# EAGLE design sx-fundec45-rev3 (EAGLE 6.5.0)
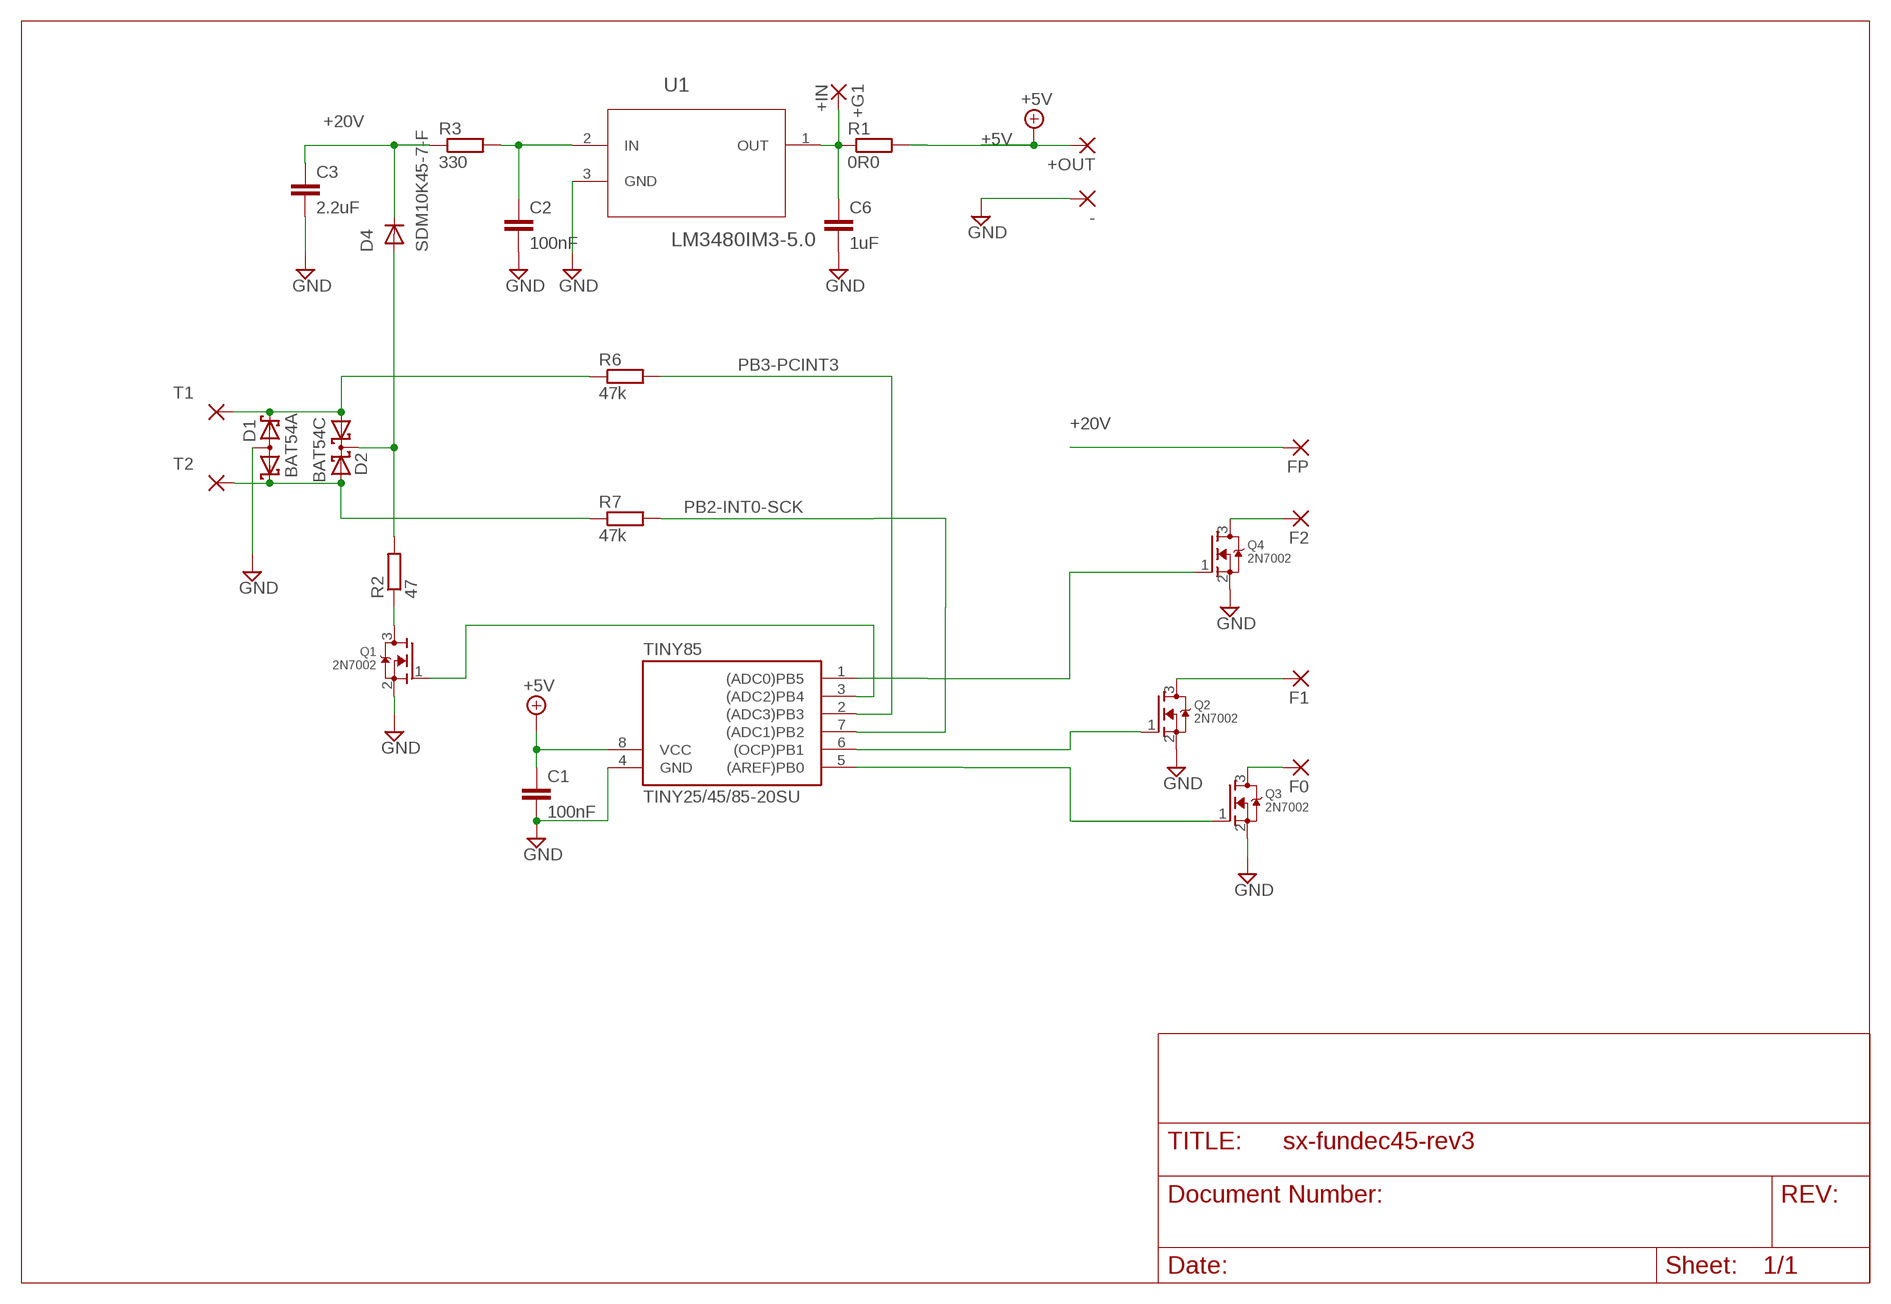
[diagram p0: schematic, sheet 1]

## Parts
+G1  +IN  SMD2  [SMD1,27-2,54]
+OUT  SMD2  [SMD1,27-2,54]
-  SMD2  [SMD1,27-2,54]
C1  100nF  C-EUC0805  [C0805]
C2  100nF  C-EUC0805  [C0805]
C3  2.2uF  C-EUC1206  [C1206]
C6  1uF  C-EUC0805  [C0805]
D1  BAT54A  [SOT23]
D2  BAT54C  [SOT23]
D4  SDM10K45-7-F  DIODE-SOD323-R  [SOD323-R]
F0  SMD2  [SMD1,27-2,54]
F1  SMD2  [SMD1,27-2,54]
F2  SMD2  [SMD1,27-2,54]
FP  SMD2  [SMD1,27-2,54]
Q1  2N7002  MOSFET-NREFLOW  [SOT23]
Q2  2N7002  MOSFET-NREFLOW  [SOT23]
Q3  2N7002  MOSFET-NREFLOW  [SOT23]
Q4  2N7002  MOSFET-NREFLOW  [SOT23]
R1  0R0  R-EU_M0805  [M0805]
R2  47  R-EU_R0805  [R0805]
R3  330  R-EU_M0805  [M0805]
R6  47k  R-EU_R0805  [R0805]
R7  47k  R-EU_M0805  [M0805]
T1  SMD2  [SMD1,27-2,54]
T2  SMD2  [SMD1,27-2,54]
TINY85  TINY25/45/85-20SU  [SOIC8]
U1  LM3480IM3-5.0  [SOT95P263X110-3N]

## Nets
+5V: +OUT.1(P) C1.1 R1.2 TINY85.8(VCC)
+20V: C3.1 D4.C FP.1(P) R3.1
+IN: +G1.1(P) C6.1 R1.1 U1.1(OUT)
F2: Q4.1(G) TINY85.1((ADC0)PB5)
GND: -.1(P) C1.2 C2.2 C3.2 C6.2 D1.3(AA) Q1.2(S) Q2.2(S) Q3.2(S) Q4.2(S) TINY85.4(GND) U1.3(GND)
MISO: Q2.1(G) TINY85.6((OCP)PB1)
MOSI: Q3.1(G) TINY85.5((AREF)PB0)
N$2: D2.3(CC) D4.A R2.2
N$4: Q1.3(D) R2.1
N$5: Q1.1(G) TINY85.3((ADC2)PB4)
N$6: D1.2(K2) D2.1(A1) R6.1 T1.1(P)
N$7: C2.1 R3.2 U1.2(IN)
N$8: F1.1(P) Q2.3(D)
N$9: F0.1(P) Q3.3(D)
N$10: F2.1(P) Q4.3(D)
PB2-INT0-SCK: R7.2 TINY85.7((ADC1)PB2)
PB3-PCINT3: R6.2 TINY85.2((ADC3)PB3)
TR-L: D1.1(K1) D2.2(A2) R7.1 T2.1(P)

## Library data of the parts
+G1 +OUT - F0 F1 F2 FP T1 T2 = wirepad:SMD2: SMD PAD
C1-C3 C6 = rcl:C-EU: CAPACITOR, European symbol
D1 = diode:BAT54A: Schottky Diodes Source: Fairchild .. BAT54.pdf
D2 = diode:BAT54C: Schottky Diodes Source: Fairchild .. BAT54.pdf
D4 = diode:DIODE-: DIODE
Q1-Q4 = adafruit:MOSFET-N: N-Channel Mosfet 2N7002E - 60V 260mA SOT23 [Digikey: 2N7002ET1GOSTR-ND] - REEL BSH103 - 30V 850mA SOT23 [Digikey: 568-5013-1-ND]
R1-R3 R6 R7 = rcl:R-EU_: RESISTOR, European symbol
TINY85 = avr-7:TINY25/45/85
U1 = lm3480:LM3480IM3-5.0: Linear Voltage Regulator; MPN: LM3480IM3-50; OC_FARNELL: 3160634; OC_NEWARK: 83F3816; PACKAGE: SOT-23-3; SUPPLIER: National Semiconductors

## Board
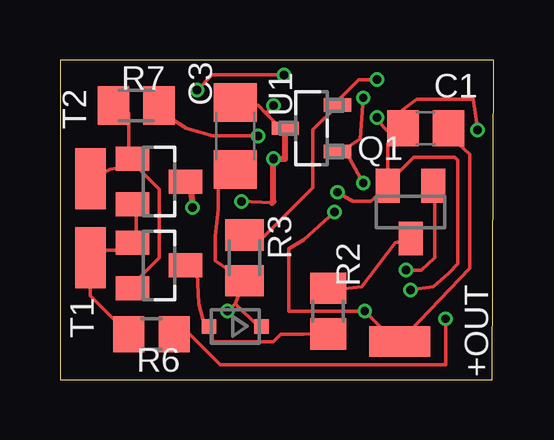
[diagram p1: board, top side]
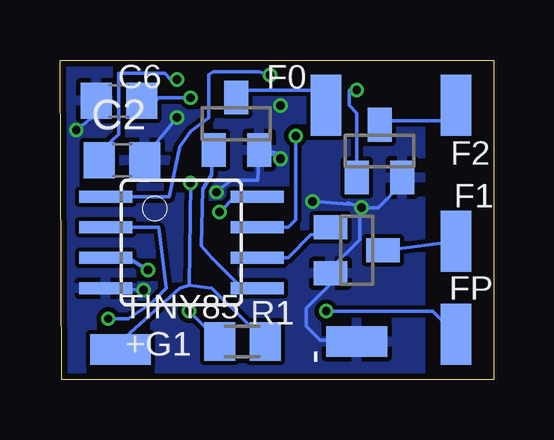
[diagram p2: board, bottom side, seen from below]

Size 18.08 x 13.32 mm. Coordinates in mm from the lower left corner, seen from the top.
Outline: 0,0 18.01,0 18.08,13.32 0,13.32 0,0
Copper layers (1*16): Top 0.035mm / dielectric 1.55mm / Bottom 0.035mm
Design rules "eC_2Layer_PClass6_BaseCopperO35": minimum track width 0.15mm, minimum drill 0.35mm, track to track 0.175mm, track to pad 0.175mm, pad to pad 0.175mm, via to via 0.175mm, smd to smd 0mil, copper to edge 0.25mm, drill to drill 0.35mm, minimum pad ring 0.175mm, minimum via ring 0.125mm, stop-mask expansion 0mil, vias tented up to drill 0.45mm, thermal gap 0.2mm

### Footprints (pad centres in the part's own frame; a part is rotated, then mirrored left to right if it is on the bottom)
SMD1,27-2,54 = smd 1.27 x 2.54: 1 0,0
C0805 = smd 1.3 x 1.5: 1 -0.95,0; 2 0.95,0
C1206 = smd 1.6 x 1.8: 1 -1.4,0; 2 1.4,0
SOT23 = smd 1 x 1.4: 1 -0.95,-1.1; 2 0.95,-1.1; 3 0,1.1
SOD323-R = smd 0.6 x 0.6: A 1.1,0; C -1.1,0
M0805 = smd 1.3 x 1.6: 1 -0.95,0; 2 0.95,0
R0805 = smd 1.3 x 1.5: 1 -0.95,0; 2 0.95,0
SOIC8 = smd 0.5 x 2.2: 1 -1.905,-3.154; 2 -0.645,-3.154; 3 0.625,-3.154; 4 1.895,-3.154; 5 1.905,3.154; 6 0.635,3.154; 7 -0.635,3.154; 8 -1.905,3.154
SOT95P263X110-3N = smd 0.559 x 1.143: 1 -0.965,-1.092; 2 0.965,-1.092; 3 0,1.092

### Placement (x,y rotation side)
+G1  15.56,1.27 270 bottom
+OUT  14.16,1.59 270 top
-  5.71,1.59 90 bottom
C1  15.24,10.48 180 top
C2  15.49,9.14 0 bottom
C3  7.3,10.16 90 top
C6  15.62,11.62 180 bottom
D1  4.13,8.26 270 top
D2  4.13,4.76 270 top
D4  7.3,2.22 180 top
F0  6.99,11.43 180 bottom
F1  1.59,5.78 180 bottom
F2  1.59,11.43 180 bottom
FP  1.59,1.91 0 bottom
Q1  14.61,6.99 180 top
Q2  5.71,5.4 270 bottom
Q3  10.73,10.67 0 bottom
Q4  4.76,9.53 0 bottom
R1  10.48,1.59 180 bottom
R2  11.18,2.86 270 top
R3  7.68,5.08 90 top
R6  3.81,1.91 0 top
R7  3.17,11.43 0 top
T1  1.27,5.08 0 top
T2  1.27,8.38 0 top
TINY85  13.02,5.71 270 bottom
U1  10.48,10.48 90 top

### Tracks (layer width: path | path; a pad name or v marks a point on that pad's centre or on a via)
+5V  (via drill 0.35)
  Top 0.15: C1.1 15.88,10.48 17.08,9.4 17.08,4.64 +OUT.1 13.65,1.91 v12.7,2.86 9.53,2.86 9.53,5.46 10.16,5.84 v11.43,6.99
  Bottom 0.15: v12.7,2.86 R1.2 | v11.43,6.99 10.79,7.62 10.16,7.62 TINY85.8
+20V  (via drill 0.35)
  Top 0.15: 7.3,3.17 8.26,2.22 D4.C | R3.1 7.3,4.45 R3.1 | R3.1 7.3,3.17 | C3.1 6.6,8.76 6.6,7.37 6.6,7.11 6.48,5.97 6.48,4.96 R3.1 | 7.3,3.17 v6.99,2.86
  Bottom 0.15: FP.1 2.54,2.86 v6.99,2.86
+IN  (via drill 0.35)
  Top 0.15: 11.75,9.53 12.51,10.03 v12.64,11.75 | 11.75,9.53 U1.1 11.75,9.53 | 11.75,9.53 12.06,9.21 v12.64,8.19
  Bottom 0.15: v12.64,11.75 13.97,11.75 14.29,11.43 C6.1 | 12.7,3.94 13.08,3.81 15.56,1.59 +G1.1 | 12.7,3.94 11.75,3.81 10.16,2.22 9.84,2.22 9.84,1.59 R1.1 | 12.7,3.94 v12.64,8.19
F2  (via drill 0.35)
  Top 0.15: v5.71,12.06 6.35,12.7 v9.34,12.7
  Bottom 0.15: v5.71,12.06 6.03,12.06 6.03,11.43 5.71,11.11 5.71,8.57 Q4.1 | v9.34,12.7 9.46,12.7 9.78,12.83 11.68,12.83 11.87,12.7 11.87,10.92 12.64,10.35 13.08,9.72 13.53,7.62 16.19,7.62 TINY85.1
GND  (via drill 0.35, 0.36)
  Top 0.15: 8.57,11.11 8.26,11.43 7.3,11.43 C3.2 | 8.57,11.11 9.21,10.48 U1.3 | v5.52,7.18 5.4,8.26 D1.3 | v8.89,11.43 8.57,11.11 | v17.4,10.41 17.21,11.68 16.7,11.68 14.86,11.68 14.29,11.24 C1.2 13.91,10.1 | v11.56,7.81 12.19,7.43 12.95,7.43 13.38,7.81 | 13.38,7.81 Q1.2 13.65,9.84 13.91,10.1 | v13.21,10.92 13.46,10.54 13.91,10.1 | 13.38,7.81 13.38,7.92 14.73,9.27 16.45,9.27 16.57,9.14 16.57,4.83 16.19,4.45 15.56,3.87 v14.61,3.75
  Top 0.152: v7.56,7.43 8.83,7.37
  Top 0.254: U1.3 9.38,9.21 v8.89,9.21 8.89,7.43 8.83,7.37 | 5.4,8.26 v5.52,7.18
  Bottom 0.15: C6.2 16.57,11.05 v17.4,10.41 | Q3.2 9.85,8.32 9.84,8.32 10.86,8.32 | 10.86,8.32 10.92,8.32 | 10.92,8.32 10.86,8.32 | 10.86,8.32 10.92,8.32 | 10.92,8.32 11.37,8 v11.56,7.81 | C2.2 14.54,9.27 v13.21,10.92 | v14.61,3.75 TINY85.4 | -.1 5.78,1.65 7.24,1.65 7.81,2.22 7.81,2.98 6.82,3.98 Q2.2 6.82,4.62 5.59,5.84 5.59,7.11 v5.52,7.18 4.83,7.18 3.81,8.19 Q4.2
  Bottom 0.152: v5.52,7.18 6.1,7.37 6.03,7.3 v7.56,7.43
  Bottom 0.254: Q3.2 8.89,9.38 v8.89,9.21
  pour Bottom: 3.05,13.34 18.1,13.34 18.1,0 3.05,0
MISO
  Bottom 0.15: Q2.1 6.99,6.03 7.62,6.03 8.57,5.08 9.84,5.08 TINY85.6
MOSI
  Bottom 0.15: Q3.1 11.75,9.53 11.75,8.57 12.13,7.94 12.19,5.59 11.75,5.08 10.48,3.81 10.16,3.81 TINY85.5
N$2
  Top 0.15: D2.3 5.4,4.76 5.71,4.45 5.78,3.17 6.03,2.22 D4.A 6.35,2.22 6.35,1.59 8.89,1.59 9.21,1.91 10.16,1.91 R2.2
N$4
  Top 0.15: Q1.3 13.97,5.71 12.57,3.87 11.43,3.75 R2.1
N$5  (via drill 0.35)
  Top 0.15: v14.41,4.57 15.05,4.57 15.62,5.08 15.62,7.3 Q1.1
  Bottom 0.15: v14.41,4.57 15.24,5.08 15.88,5.08 TINY85.3
N$6
  Top 0.15: D1.2 3.17,7.3 3.17,5.71 D2.1 2.86,5.4 1.27,5.4 T1.1 1.27,3.49 R6.1
N$7  (via drill 0.35)
  Top 0.15: R3.2 7.75,5.97 8.51,5.97 10.54,8 10.54,10.41 U1.2 11.57,11.63 12.45,12.51 13.08,12.51 v13.21,12.51
  Bottom 0.15: v13.21,12.51 13.46,12.51 13.72,12.76 15.62,12.76 15.62,10.22 16.26,9.65 16.95,9.71 C2.1
N$8
  Bottom 0.15: F1.1 4.45,5.4 Q2.3
N$9
  Bottom 0.15: F0.1 7.62,12.06 10.79,12.06 Q3.3
N$10
  Bottom 0.15: F2.1 2.22,10.79 4.76,10.79 Q4.3
PB2-INT0-SCK  (via drill 0.35)
  Top 0.15: v8.26,10.16 6.35,10.16 5.27,10.48 4.38,11.05 R7.2
  Bottom 0.15: v8.26,10.16 8.26,6.67 8.57,6.35 9.84,6.35 TINY85.7
PB3-PCINT3  (via drill 0.35)
  Top 0.15: v16.07,2.54 16.07,0.64 6.67,0.64 5.4,1.91 R6.2
  Bottom 0.15: v16.07,2.54 15.24,2.54 14.29,3.17 13.65,3.81 13.97,6.35 15.88,6.35 TINY85.2
TR-L
  Top 0.15: D2.2 3.17,4.13 4.13,5.08 4.13,7.94 3.17,8.89 D1.1 | R7.1 2.54,11.43 2.86,11.11 2.86,9.21 D1.1 | T2.1 2.1,8.76 2.86,8.89 D1.1